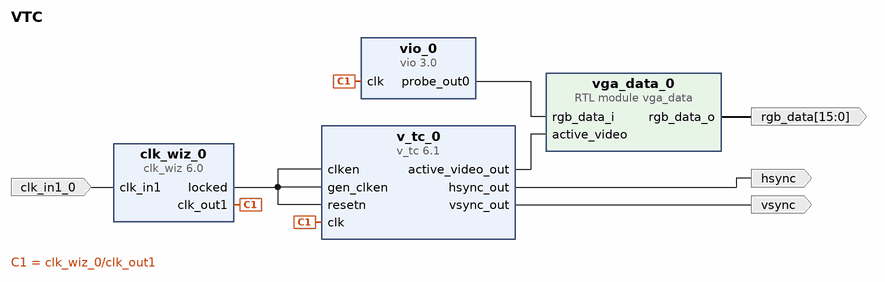
[diagram p0: block diagram of the top level]
# Vivado block design VTC, xc7z010clg400-1, Vivado 2019.1
create_bd_design VTC

create_bd_port -dir O hsync
create_bd_port -dir O vsync
create_bd_port -dir I -type clk clk_in1_0
set_property -dict {CONFIG.FREQ_HZ 50000000} [get_bd_ports clk_in1_0]
create_bd_port -dir O -from 15 -to 0 rgb_data

create_bd_cell -type ip -vlnv xilinx.com:ip:v_tc:6.1 v_tc_0
set_property -dict {CONFIG.HAS_AXI4_LITE false CONFIG.VIDEO_MODE 800x600p CONFIG.enable_detection false} [get_bd_cells v_tc_0]
create_bd_cell -type ip -vlnv xilinx.com:ip:clk_wiz:6.0 clk_wiz_0
set_property -dict [list \
  CONFIG.CLKIN1_JITTER_PS 200.0 \
  CONFIG.CLKOUT1_JITTER 204.383 \
  CONFIG.CLKOUT1_PHASE_ERROR 164.985 \
  CONFIG.CLKOUT1_REQUESTED_OUT_FREQ 40.000 \
  CONFIG.MMCM_CLKFBOUT_MULT_F 20.000 \
  CONFIG.MMCM_CLKIN1_PERIOD 20.000 \
  CONFIG.MMCM_CLKIN2_PERIOD 10.0 \
  CONFIG.MMCM_CLKOUT0_DIVIDE_F 25.000 \
  CONFIG.PRIM_IN_FREQ 50.000 \
  CONFIG.USE_RESET false \
] [get_bd_cells clk_wiz_0]
create_bd_cell -type module -reference vga_data vga_data_0
create_bd_cell -type ip -vlnv xilinx.com:ip:vio:3.0 vio_0
set_property -dict {CONFIG.C_NUM_PROBE_IN 0 CONFIG.C_PROBE_OUT0_WIDTH 16} [get_bd_cells vio_0]

# ---- connections ----

connect_bd_net [get_bd_pins v_tc_0/hsync_out] [get_bd_ports hsync]
connect_bd_net [get_bd_pins v_tc_0/vsync_out] [get_bd_ports vsync]
connect_bd_net -net clk_in1_0_1 [get_bd_ports clk_in1_0] [get_bd_pins clk_wiz_0/clk_in1]
connect_bd_net [get_bd_pins clk_wiz_0/clk_out1] [get_bd_pins v_tc_0/clk] [get_bd_pins vio_0/clk]
connect_bd_net [get_bd_pins clk_wiz_0/locked] [get_bd_pins v_tc_0/clken] [get_bd_pins v_tc_0/gen_clken] [get_bd_pins v_tc_0/resetn]
connect_bd_net [get_bd_pins v_tc_0/active_video_out] [get_bd_pins vga_data_0/active_video]
connect_bd_net [get_bd_pins vga_data_0/rgb_data_o] [get_bd_ports rgb_data]
connect_bd_net [get_bd_pins vio_0/probe_out0] [get_bd_pins vga_data_0/rgb_data_i]

validate_bd_design
save_bd_design
